# EAGLE schematic batteryBalancer (EAGLE 8.0.0)
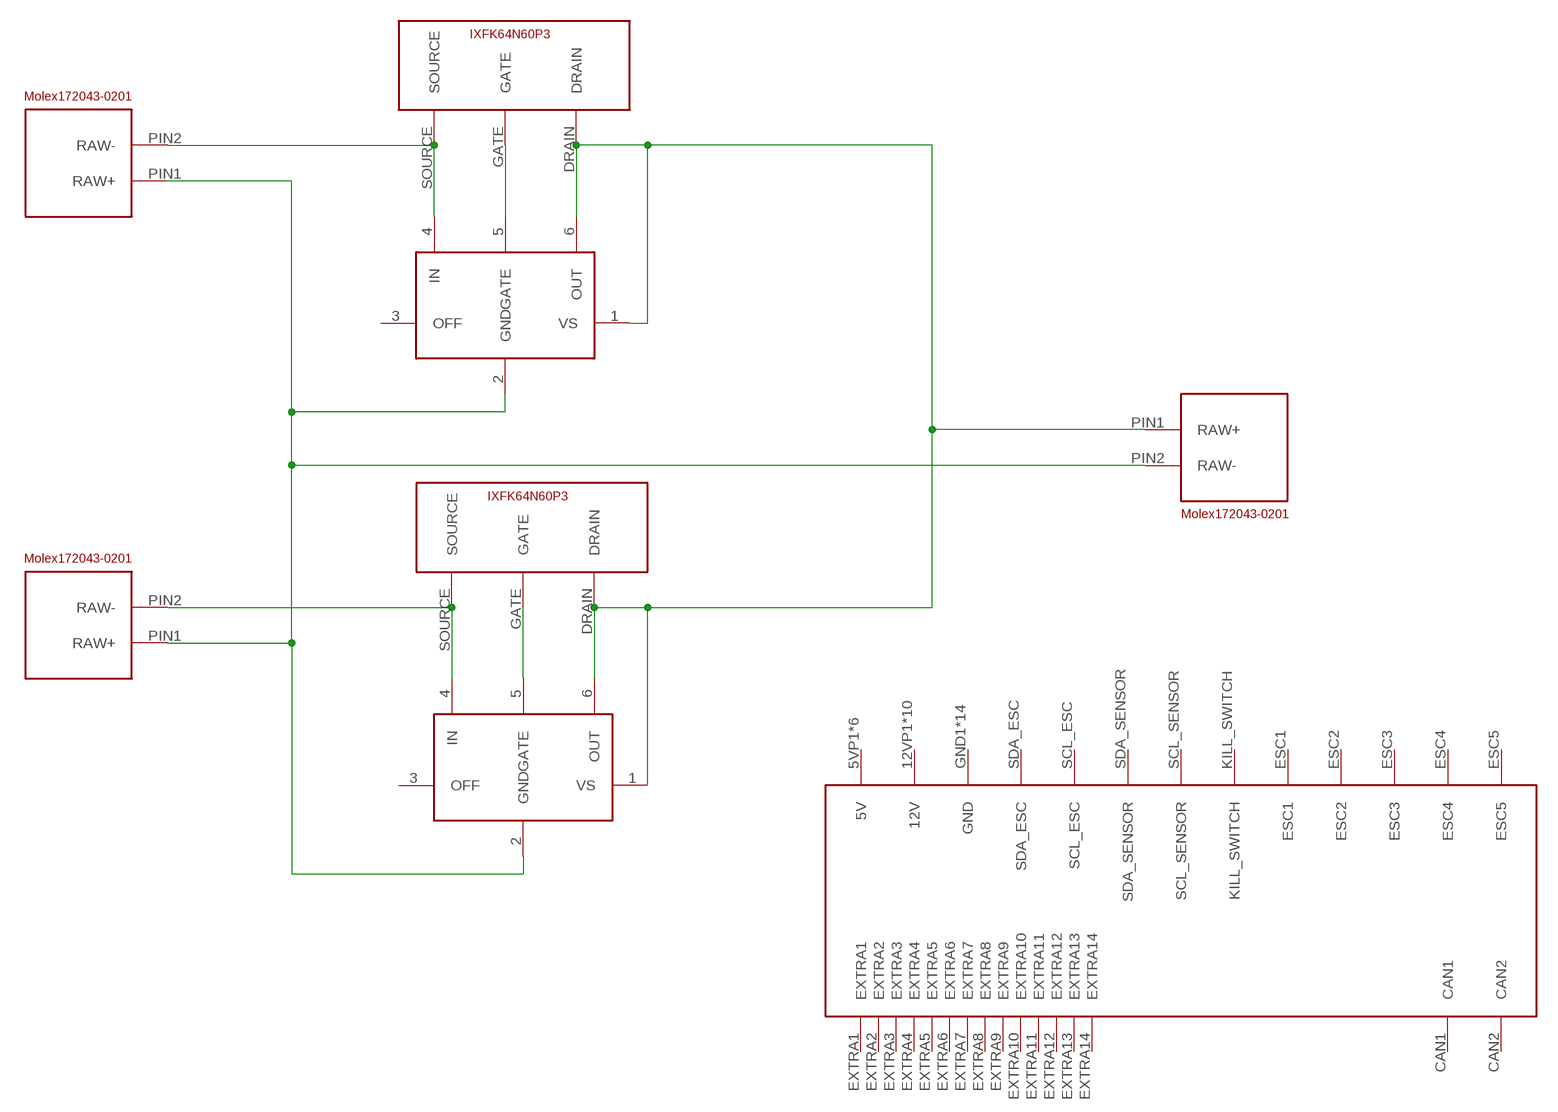
[diagram p0: schematic, sheet 1]

## Parts
BAT_IN_1  MOLEX172043-0201  [MOLEX172043-0201]
BAT_IN_2  MOLEX172043-0201  [MOLEX172043-0201]
BAT_OUT  MOLEX172043-0201  [MOLEX172043-0201]
U$1  IXFK64N60P3  [IXFK64N60P3]
U$2  IXFK64N60P3  [IXFK64N60P3]
U$3  LM5050-1  [SOT23-6]
U$4  LM5050-1  [SOT23-6]
U$5  5530843  [5530843-6-BOARDFINGERS]

## Nets
BALENCED_LOAD: BAT_OUT.PIN1(RAW+) U$1.DRAIN U$2.DRAIN U$3.1(VS) U$3.6(OUT) U$4.1(VS) U$4.6(OUT)
BAT_GND: BAT_IN_1.PIN1(RAW+) BAT_IN_2.PIN1(RAW+) BAT_OUT.PIN2(RAW-) U$3.2(GND) U$4.2(GND)
GATE_1: U$1.GATE U$3.5(GATE)
LOAD_1: BAT_IN_1.PIN2(RAW-) U$1.SOURCE U$3.4(IN)
LOAD_2: BAT_IN_2.PIN2(RAW-) U$2.SOURCE U$4.4(IN)
N$1: U$2.GATE U$4.5(GATE)
Unconnected: U$3.3(OFF) U$4.3(OFF) U$5.5VP1(5V) U$5.5VP2(5V) U$5.5VP3(5V) U$5.5VP4(5V) U$5.5VP5(5V) U$5.5VP6(5V) U$5.12VP1(12V) U$5.12VP2(12V) U$5.12VP3(12V) U$5.12VP4(12V) U$5.12VP5(12V) U$5.12VP6(12V) U$5.12VP7(12V) U$5.12VP8(12V) U$5.12VP9(12V) U$5.12VP10(12V) U$5.CAN1 U$5.CAN2 U$5.ESC1 U$5.ESC2 U$5.ESC3 U$5.ESC4 U$5.ESC5 U$5.EXTRA1 U$5.EXTRA2 U$5.EXTRA3 U$5.EXTRA4 U$5.EXTRA5 U$5.EXTRA6 U$5.EXTRA7 U$5.EXTRA8 U$5.EXTRA9 U$5.EXTRA10 U$5.EXTRA11 U$5.EXTRA12 U$5.EXTRA13 U$5.EXTRA14 U$5.GND1(GND) U$5.GND2(GND) U$5.GND3(GND) U$5.GND4(GND) U$5.GND5(GND) U$5.GND6(GND) U$5.GND7(GND) U$5.GND8(GND) U$5.GND9(GND) U$5.GND10(GND) U$5.GND11(GND) U$5.GND12(GND) U$5.GND13(GND) U$5.GND14(GND) U$5.KILL_SWITCH U$5.SCL_ESC U$5.SCL_SENSOR U$5.SDA_ESC U$5.SDA_SENSOR

## Library data of the parts
BAT_IN_1 BAT_IN_2 BAT_OUT = Molex172043-0201-no_slots:MOLEX172043-0201
U$1 U$2 = IXFK64N60P3:IXFK64N60P3
U$3 U$4 = lio:LM5050-1
U$5 = 5530843-6:5530843: TE-CONNECTIVITY 5530843 EDGE CONNECTOR